# EAGLE design IV STAGE (EAGLE 5.07)
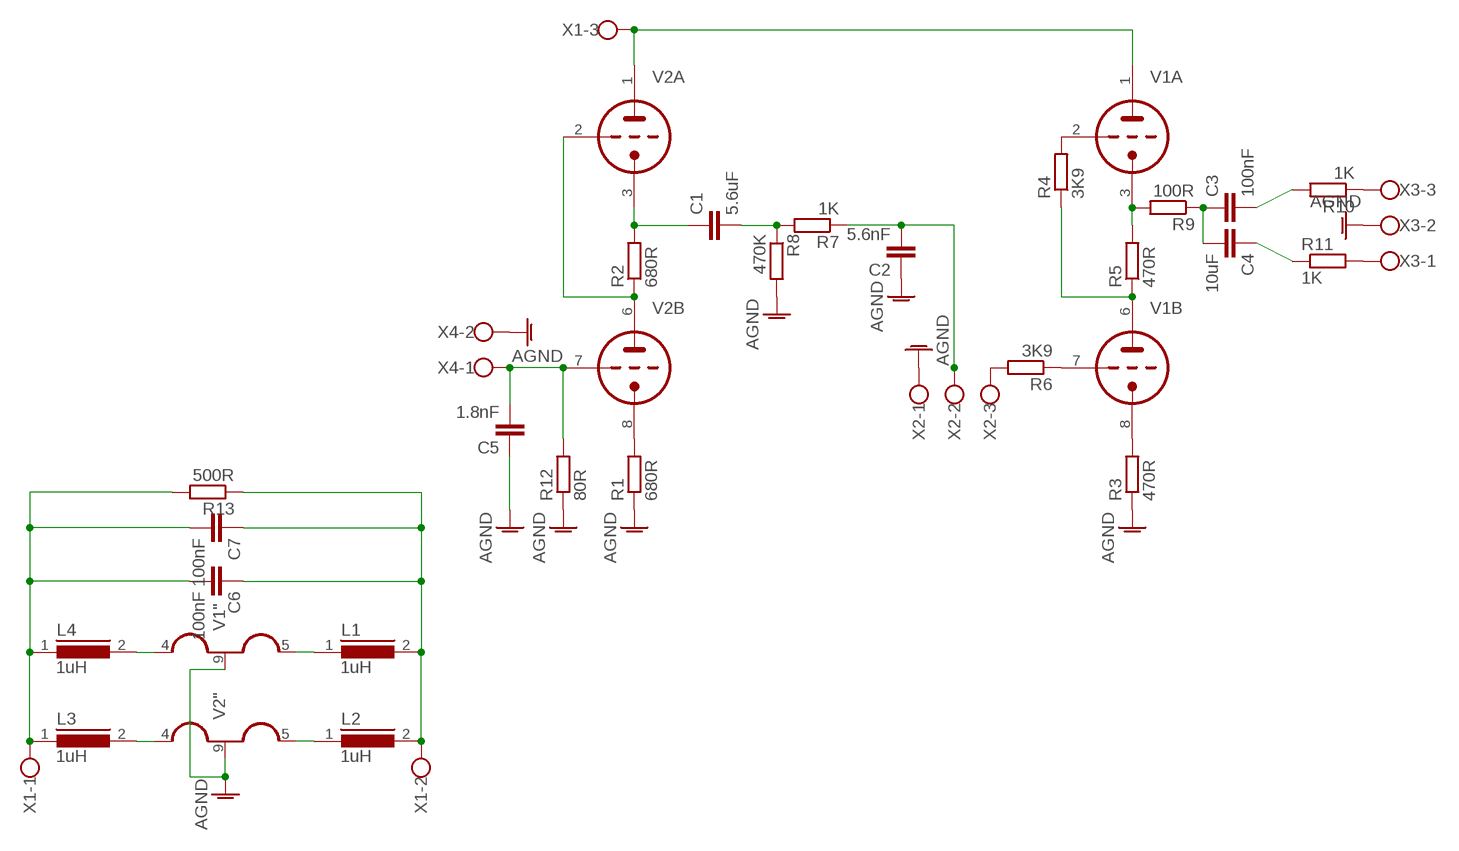
[diagram p0: schematic, sheet 1]

## Parts
C1  5.6uF  C-EU225-074X268  [C225-074X268]
C2  5.6nF  C-EU050-050X075  [C050-050X075]
C3  100nF  C-EU150-064X183  [C150-064X183]
C4  10uF  C-EU150-064X183  [C150-064X183]
C5  1.8nF  C-EU102-043X133  [C102-043X133]
C6  100nF  C-EU050-055X075  [C050-055X075]
C7  100nF  C-EU050-055X075  [C050-055X075]
L1  1uH  B82131  [SUKW1-17]
L2  1uH  B82131  [SUKW1-17]
L3  1uH  B82131  [SUKW1-17]
L4  1uH  B82131  [SUKW1-17]
R1  680R  R-EU_0309/12  [0309/12]
R2  680R  R-EU_0309/12  [0309/12]
R3  470R  R-EU_0309/12  [0309/12]
R4  3K9  R-EU_0309/12  [0309/12]
R5  470R  R-EU_0309/12  [0309/12]
R6  3K9  R-EU_0309/12  [0309/12]
R7  1K  R-EU_0613/15  [P0613/15]
R8  470K  R-EU_0309/12  [0309/12]
R9  100R  R-EU_0617/17  [0617/17]
R10  1K  R-EU_0613/15  [P0613/15]
R11  1K  R-EU_0613/15  [P0613/15]
R12  80R  R-EU_0309/12  [0309/12]
R13  500R  R-EU_0613/15  [P0613/15]
V1  ECC88-P  [NOVAL]
V2  ECC88-P  [NOVAL]
X1  W237-03P  [W237-133]
X2  W237-03P  [W237-133]
X3  W237-03P  [W237-133]
X4  W237-02P  [W237-132]

## Nets
AGND: C2.1 C5.1 R1.1 R3.1 R8.2 R12.1 V1.9(":H2) V2.9(":H2) X2.1 X3.2 X4.2
N$1: L1.1 V1.5(":H3)
N$2: L2.1 V2.5(":H3)
N$3: L3.2 V2.4(":H1)
N$4: L4.2 V1.4(":H1)
N$5: C6.2 C7.2 L3.1 L4.1 R13.2 X1.1
N$6: C6.1 C7.1 L1.2 L2.2 R13.1 X1.2
N$7: V1.1(A:TA) V2.1(A:TA) X1.3
N$8: R5.2 R9.2 V1.3(A:TK)
N$9: R6.1 V1.7(B:TG)
N$10: R2.1 V2.2(A:TG) V2.6(B:TA)
N$11: R1.2 V2.8(B:TK)
N$12: C1.1 R2.2 V2.3(A:TK)
N$15: R3.2 V1.8(B:TK)
N$16: R4.2 V1.2(A:TG)
N$17: R4.1 R5.1 V1.6(B:TA)
N$18: R6.2 X2.3
N$19: C1.2 R7.2 R8.1
N$20: C2.2 R7.1 X2.2
N$21: C3.1 C4.2 R9.1
N$22: C3.2 R10.2
N$24: C4.1 R11.1
N$25: R10.1 X3.3
N$26: R11.2 X3.1
N$27: C5.2 R12.2 V2.7(B:TG) X4.1

## Library data of the parts
C1-C7 = resistor:C-EU: CAPACITOR, European symbol
L1-L4 = inductors:B82131: INDUCTOR
R1-R13 = resistor:R-EU_: RESISTOR, European symbol
V1 V2 = TUBE1:ECC88-P
X1-X3 = con-wago-508:W237-03P: WAGO SREW CLAMP
X4 = con-wago-508:W237-02P: WAGO SREW CLAMP

## Board
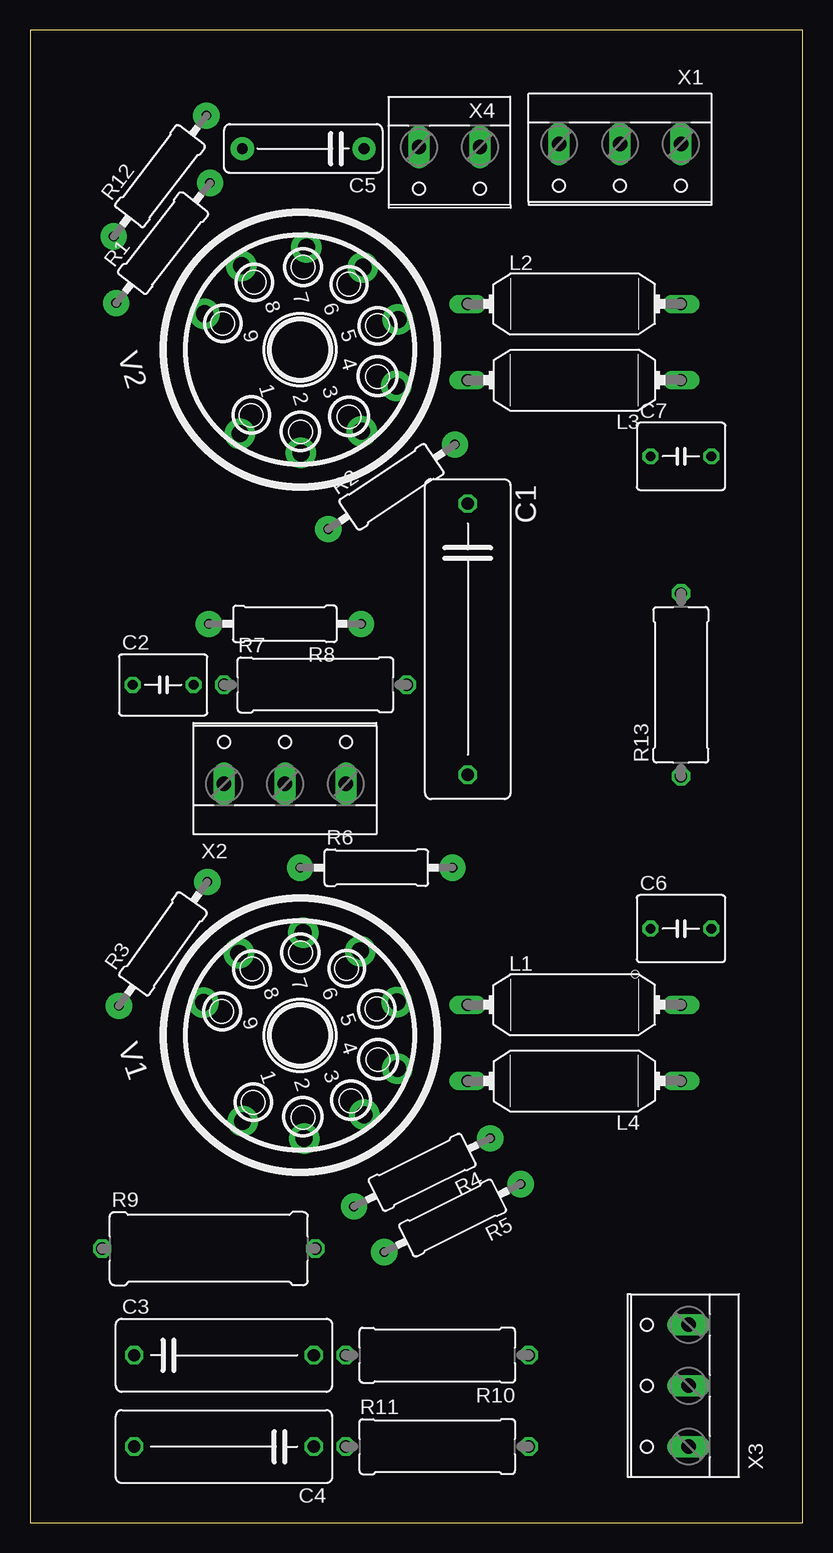
[diagram p1: board, top side]
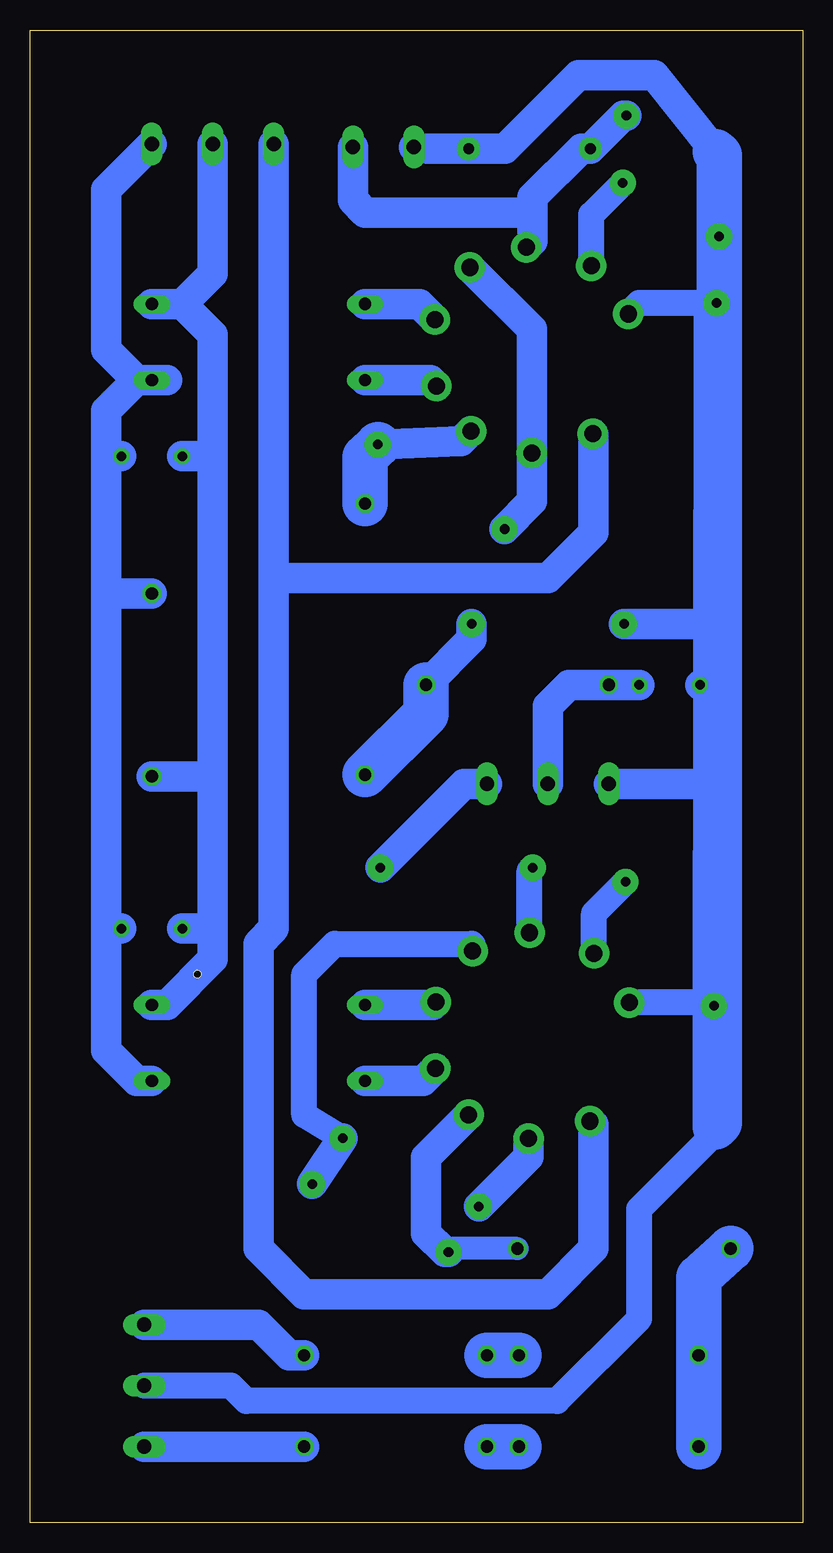
[diagram p2: board, bottom side, seen from below]

Size 64.44 x 124.44 mm. Coordinates in mm from the lower left corner, seen from the top.
Outline: 64.44,0 64.44,124.44 0,124.44 0,0 64.44,0
Copper layers (1*16): Top 0.035mm / dielectric 1.5mm / Bottom 0.035mm
Design rules "default *": minimum track width 10mil, minimum drill 30mil, track to track 8mil, track to pad 8mil, pad to pad 8mil, via to via 8mil, smd to smd 8mil, copper to edge 40mil, drill to drill 8mil, minimum pad ring 10mil, minimum via ring 8mil, stop-mask expansion 4mil, vias tented up to drill 0mil, thermal gap 10mil
Holes 0.6 mm at 50.47,-66.04 50.47,45.72 263.83,45.72

### Footprints (pad centres in the part's own frame; a part is rotated, then mirrored left to right if it is on the bottom)
C225-074X268 = drill 1.016 octagon: 1 -11.303,0; 2 11.303,0
C050-050X075 = drill 0.813 octagon: 1 -2.54,0; 2 2.54,0
C150-064X183 = drill 1.016 octagon: 1 -7.493,0; 2 7.493,0
C102-043X133 = drill 0.9 pad 1.93 round: 1 -5.08,0; 2 5.08,0
C050-055X075 = drill 0.813 octagon: 1 -2.54,0; 2 2.54,0
SUKW1-17 = drill 1.016 long: 1 -8.89,0; 2 8.89,0
0309/12 = drill 0.8 pad 2.184 round: 1 -6.35,0; 2 6.35,0
P0613/15 = drill 1.016 octagon: 1 -7.62,0; 2 7.62,0
0617/17 = drill 1.016 octagon: 1 -8.89,0; 2 8.89,0
NOVAL = drill 1.422 pad 2.54 round: 1 5.207,-6.858; 2 8.254,-2.484; 3 8.004,2.893; 4 5.258,6.77; 5 0,8.524; 6 -5.004,7.024; 7 -8.004,3.02; 8 -8.127,-2.611; 9 -5.207,-6.731
W237-133 = drill 1.194 long: 1 -5.08,-0.635; 2 0,-0.635; 3 5.08,-0.635
W237-132 = drill 1.194 long: 1 -2.54,-0.635; 2 2.54,-0.635

### Placement (x,y rotation side)
C1  36.5,73.66 270 top
C2  11.1,69.85 0 top
C3  16.18,13.97 0 top
C4  16.18,6.35 180 top
C5  22.78,114.55 180 top
C6  54.28,49.53 0 top
C7  54.28,88.9 0 top
L1  45.39,43.18 0 top
L2  45.39,101.6 0 top
L3  45.39,95.25 180 top
L4  45.39,36.83 180 top
R1  11.1,106.68 52 top
R2  30.15,86.36 33.7 top
R3  11.1,48.26 54.5 top
R4  32.69,29.21 206.6 top
R5  35.23,25.4 206.5 top
R6  28.88,54.61 0 top
R7  23.8,69.85 0 top
R8  21.26,74.93 180 top
R9  14.91,22.86 0 top
R10  33.96,13.97 180 top
R11  33.96,6.35 0 top
R12  10.85,112.27 52.5 top
R13  54.28,69.85 90 top
V1  22.53,40.64 289 top
V2  22.53,97.79 287.2 top
X1  49.2,114.3 180 top
X2  21.26,62.23 0 top
X3  54.28,11.43 90 top
X4  34.98,114.05 180.1 top

### Tracks (layer width: path | path; a pad name or v marks a point on that pad's centre or on a via)
AGND
  Bottom 2.184: R3.1 7.69,43.37 V1.9 | R3.1 7.19,43.31 7.19,55.88 7.19,61.47 7.19,69.85 7.19,74.93 | V2.9 13.66,101.68 7.8,101.68 R1.1 | X3.2 47.68,11.43 46.41,10.16 20.5,10.16 13.64,17.02 13.64,26.16 7.54,32.26 7.54,42.96 R3.1
  Bottom 2.54: 7.19,74.93 R8.2 | 7.19,69.85 C2.1 | X2.1 7.92,61.59 7.8,61.47 7.19,61.47 | 7.8,101.68 6.98,102.49 | X4.2 31.29,114.55 C5.1 24.82,114.55 18.72,120.65 12.37,120.65 7.29,114.3 | R12.1 7.29,107.95
  Bottom 3.81: 7.29,33.02 R1.1 | R12.1 6.98,102.49 | R12.1 6.98,113.99 7.29,114.3 | R12.1 6.98,33.33 7.29,33.02 | 7.29,33.02 7.29,55.78 7.19,55.88
N$1
  Bottom 2.54: V1.5 30.82,43.18 L1.1
N$2
  Bottom 2.54: V2.5 31.96,101.6 L2.1
N$3
  Bottom 2.54: V2.4 31.03,95.25 L3.2
N$4
  Bottom 2.54: V1.4 31.69,36.83 L4.2
N$5
  Bottom 2.54: L4.1 55.55,36.83 58.09,39.37 58.09,49.53 | 58.09,49.53 58.09,77.47 | 58.09,77.47 58.09,88.9 | 58.09,88.9 58.09,92.71 55.55,95.25 | 53.01,95.25 L3.1 55.55,95.25 | 55.55,95.25 58.09,97.79 58.09,111.13 X1.1 | 58.09,49.53 C6.2 | 58.09,88.9 C7.2 | 58.09,77.47 R13.2
N$6
  Bottom 2.54: L1.2 53.01,43.18 49.2,46.99 49.2,49.53 | 49.2,49.53 49.2,62.23 | 49.2,62.23 49.2,88.9 | 49.2,88.9 49.2,99.06 51.74,101.6 | X1.2 49.2,104.14 51.74,101.6 | 51.74,101.6 L2.2 | 49.2,49.53 C6.1 | 49.2,88.9 C7.1 | 49.2,62.23 R13.1
N$7
  Bottom 2.54: V1.1 17.45,33.19 17.45,22.86 21.26,19.05 41.58,19.05 45.39,22.86 45.39,48.26 44.12,49.53 44.12,78.74 | V2.1 17.45,90.72 17.45,82.55 21.26,78.74 44.12,78.74 | 44.12,78.74 X1.3 44.12,110.49
N$8
  Bottom 1.93: R9.2 29.25,22.86 R5.2
  Bottom 2.54: V1.3 31.42,30.47 31.42,24.13 29.86,22.57 R5.2
N$9
  Bottom 2.184: R6.1 22.78,54.36 V1.7
N$10
  Bottom 2.54: R2.1 22.6,85.16 V2.2 22.6,99.48 V2.6
N$11
  Bottom 2.184: R1.2 17.63,109.06 V2.8
N$12
  Bottom 2.54: V2.3 28.49,90.17 R2.2
  Bottom 3.81: R2.2 36.5,88.82 C1.1
N$15
  Bottom 2.184: R3.2 17.41,50.8 V1.8
N$16
  Bottom 2.54: R4.2 22.87,30.51 V1.2
N$17
  Bottom 2.184: R4.1 41.58,34 41.58,45.72 39.04,48.26 27.61,48.26 27.54,48.19 V1.6
  Bottom 2.54: R4.1 R5.1
N$18
  Bottom 2.54: X2.3 28.25,61.59 R6.2
N$19
  Bottom 2.54: R8.1 27.61,73.66 R7.2
  Bottom 3.81: R7.2 31.42,67.44 C1.2
N$20
  Bottom 2.54: C2.2 R7.1 19.48,69.85 21.26,68.07 X2.2
N$21
  Bottom 3.81: C4.2 C3.1 8.69,20.45 R9.1
N$22
  Bottom 3.81: C3.2 R10.2
N$24
  Bottom 3.81: C4.1 R11.1
N$25
  Bottom 2.54: R10.1 42.85,13.97 45.39,16.51 X3.3 50.47,16.51
N$26
  Bottom 2.54: R11.2 X3.1 50.47,6.35
N$27
  Bottom 2.54: R12.2 14.95,117.31 C5.2 18.47,114.55 22.53,110.49 22.53,109.22 | 22.53,109.22 22.53,106.85 V2.7 | X4.1 37.52,110.23 36.5,109.22 22.53,109.22